# EAGLE schematic Mini Power Supply (EAGLE 6.4)
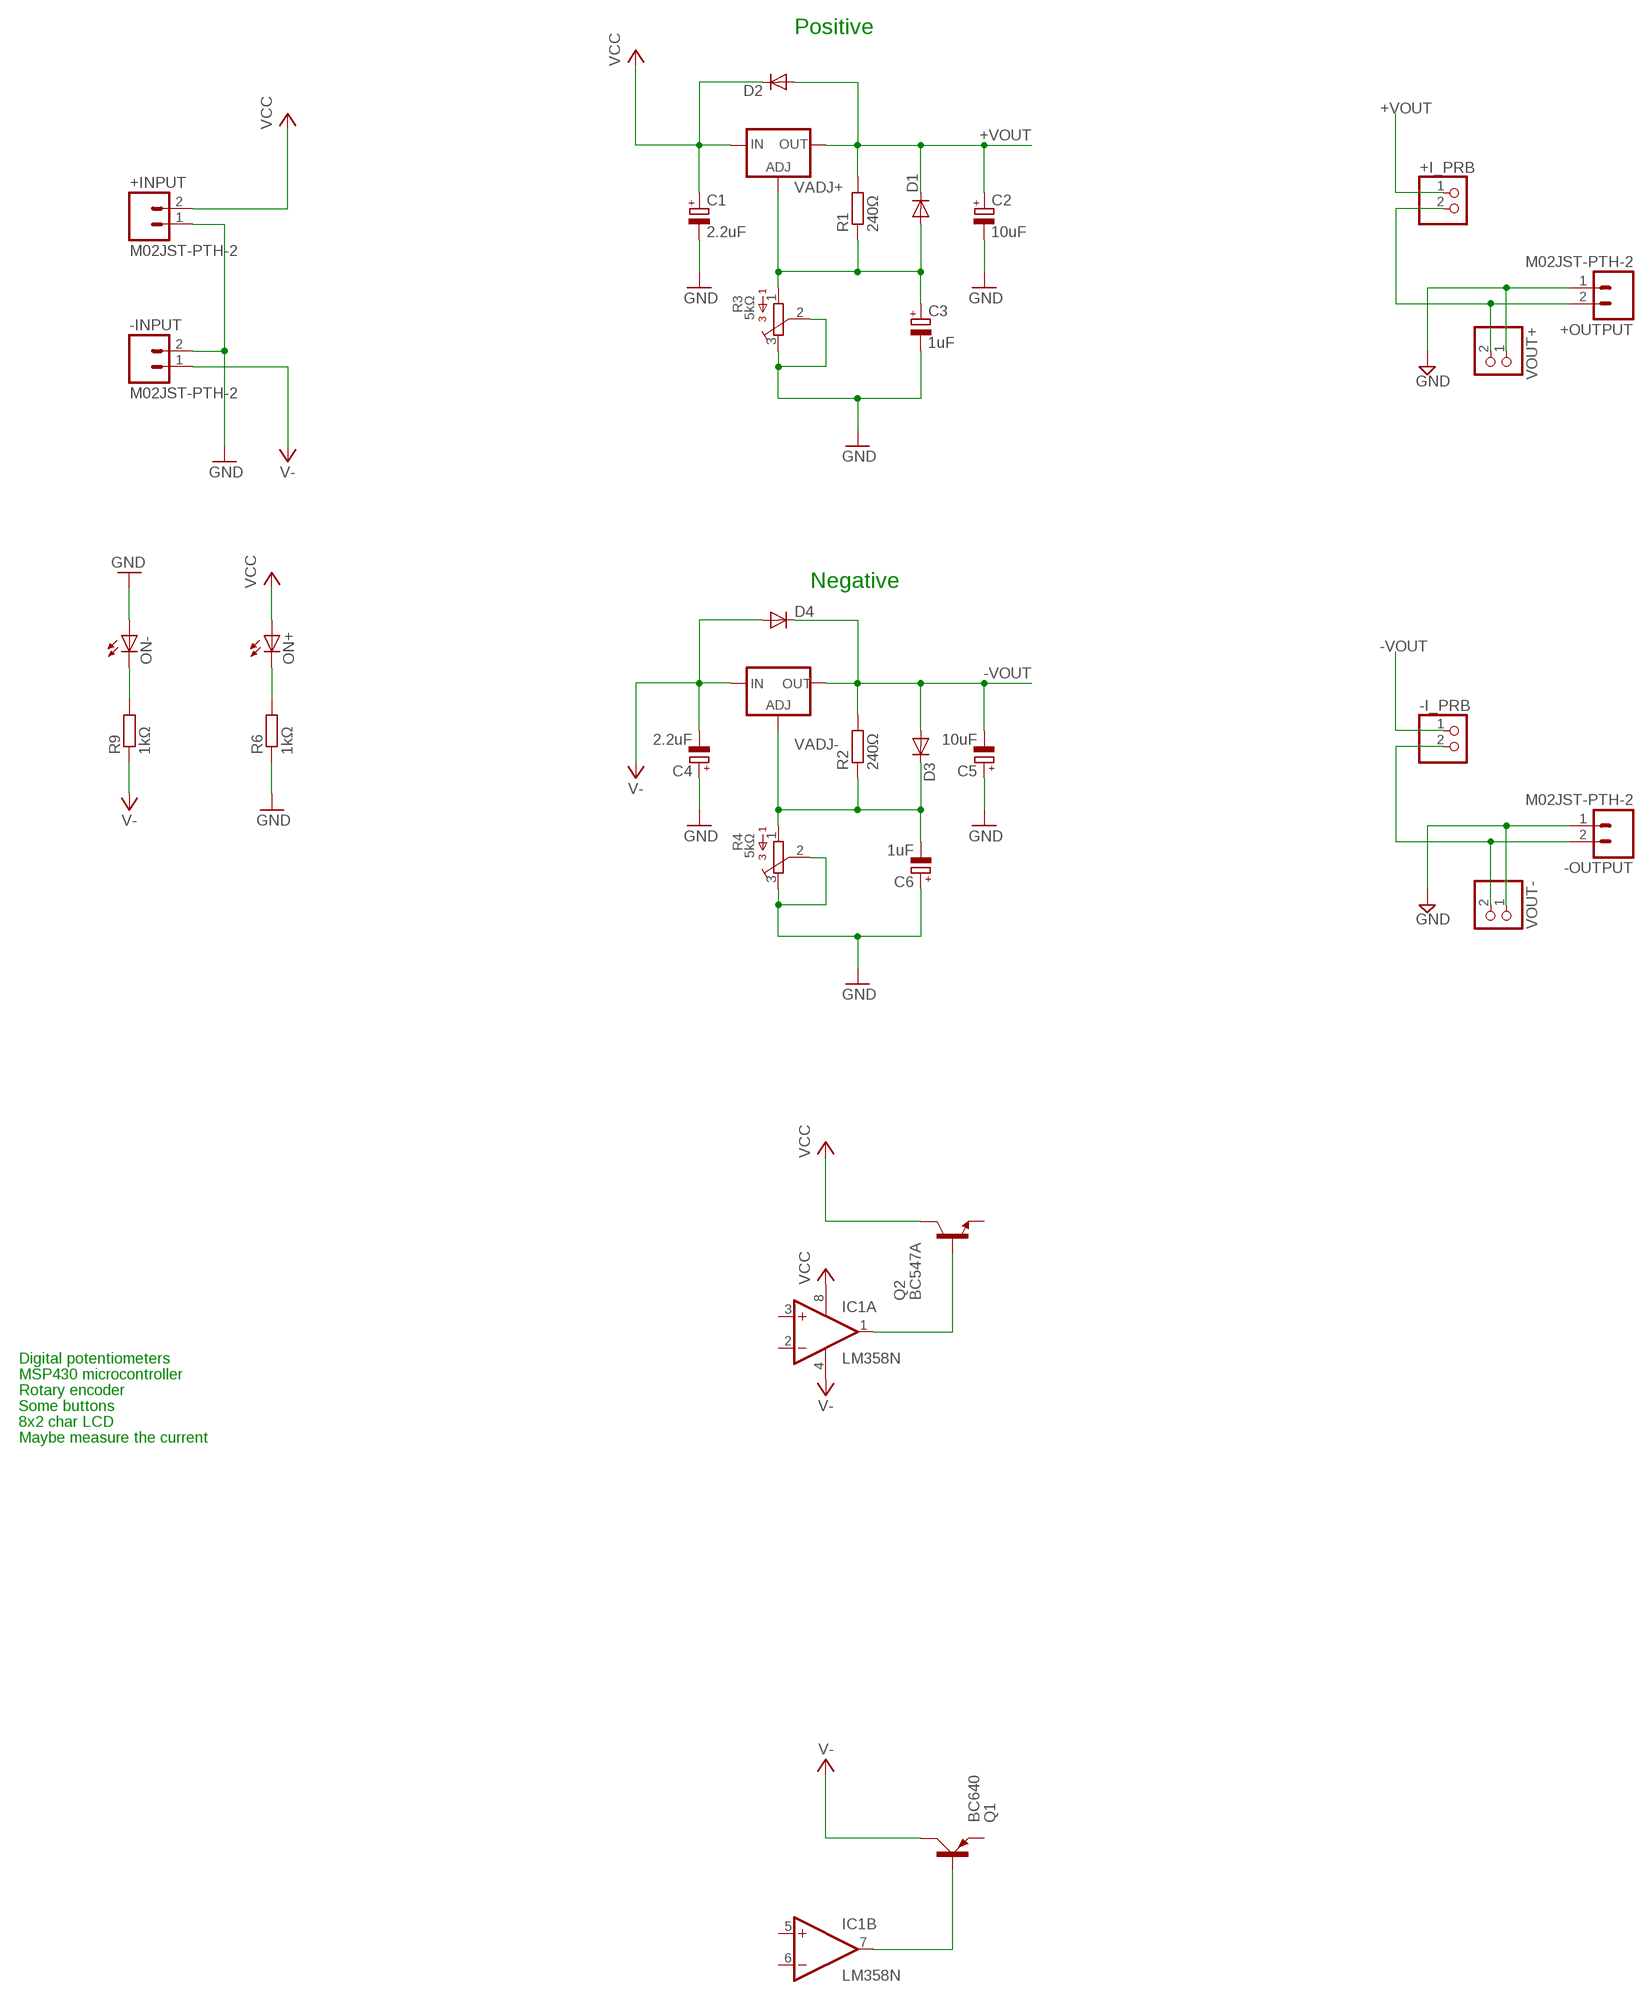
[diagram p0: schematic, sheet 1]

## Parts
+I_PRB  PINHD-1X2  [1X02]
+INPUT  M02JST-PTH-2  [JST-2-PTH]
+OUTPUT  M02JST-PTH-2  [JST-2-PTH]
-I_PRB  PINHD-1X2  [1X02]
-INPUT  M02JST-PTH-2  [JST-2-PTH]
-OUTPUT  M02JST-PTH-2  [JST-2-PTH]
C1  2.2uF  CPOL-EUE2.5-6  [E2,5-6]
C2  10uF  CPOL-EUE2.5-6  [E2,5-6]
C3  1uF  CPOL-EUE2.5-6  [E2,5-6]
C4  2.2uF  CPOL-EUE2.5-6  [E2,5-6]
C5  10uF  CPOL-EUE2.5-6  [E2,5-6]
C6  1uF  CPOL-EUE2.5-6  [E2,5-6]
D1  1N4148DO35-7  [DO35-7]
D2  1N4148DO35-7  [DO35-7]
D3  1N4148DO35-7  [DO35-7]
D4  1N4148DO35-7  [DO35-7]
IC1  LM358N  [DIL08]
ON+  LEDSQR2X5  [LED2X5]
ON-  LEDSQR2X5  [LED2X5]
Q1  BC640  [SOT54D]
Q2  BC547A  [TO92]
R1  240Ω  R-EU_0207/10  [0207/10]
R2  240Ω  R-EU_0207/10  [0207/10]
R3  5kΩ  3386-U  [3386U]
R4  5kΩ  3386-U  [3386U]
R6  1kΩ  R-EU_0207/10  [0207/10]
R9  1kΩ  R-EU_0207/10  [0207/10]
VADJ+  LM317L  [317L]
VADJ-  LM337L  [337L]
VOUT+  PINHD-1X2  [1X02]
VOUT-  PINHD-1X2  [1X02]

## Nets
+VOUT: +I_PRB.1 C2.+ D1.C D2.A R1.2 VADJ+.2(OUT)
-VOUT: -I_PRB.1 C5.- D3.A D4.C R2.2 VADJ-.OUT
GND: +INPUT.1 +OUTPUT.1 -INPUT.2 -OUTPUT.1 C1.- C2.- C3.- C4.+ C5.+ C6.+ ON-.A R3.2 R3.3 R4.2 R4.3 R6.1 VOUT+.1 VOUT-.1
N$1: C6.- D3.C R2.1 R4.1 VADJ-.ADJ
N$2: IC1.1(A:OUT) Q2.2(B)
N$3: C3.+ D1.A R1.1 R3.1 VADJ+.1(ADJ)
N$4: ON-.K(C) R9.2
N$5: IC1.7(B:OUT) Q1.B
N$6: ON+.K(C) R6.2
N$7: +I_PRB.2 +OUTPUT.2 VOUT+.2
N$10: -I_PRB.2 -OUTPUT.2 VOUT-.2
V-: -INPUT.1 C4.- D4.A IC1.4(P:V-) Q1.C R9.1 VADJ-.IN
VCC: +INPUT.2 C1.+ D2.C IC1.8(P:V+) ON+.A Q2.3(C) VADJ+.3(IN)
Unconnected: IC1.2(A:-IN) IC1.3(A:+IN) IC1.5(B:+IN) IC1.6(B:-IN) Q1.E Q2.1(E)

## Notes on the sheet
- Positive
- Negative
- Digital potentiometers
- MSP430 microcontroller
- Rotary encoder
- Some buttons
- 8x2 char LCD
- Maybe measure the current

## Library data of the parts
+I_PRB -I_PRB VOUT+ VOUT- = pinhead:PINHD-1X2: PIN HEADER
+INPUT +OUTPUT -INPUT -OUTPUT = SparkFun-Connectors:M02: Standard 2-pin 0.1" header. Use with - straight break away headers ( PRT-00116) - right angle break away headers (PRT-00553) - swiss pins (PRT-00743) - machine pins (PRT-00117) - female headers (PRT-00115) Molex polarized connector foot print use with: PRT-08233 with associated crimp pins and housings. 2.54_SCREWTERM for use with PRT-10571. 3.5mm Screw Terminal footprints for PRT-08084 5mm Screw Terminal footprints for use with PRT-08433
C1-C6 = rcl:CPOL-EU: POLARIZED CAPACITOR, European symbol
D1-D4 = diode:1N4148: DIODE high speed (Philips)
IC1 = linear:LM358: OP AMP also LM158; LM258; LM2904 Source: http://cache.national.com/ds/LM/LM158.pdf
ON+ ON- = led:LED: LED OSRAM: - CHIPLED LG R971, LG N971, LY N971, LG Q971, LY Q971, LO R971, LY R971 LH N974, LH R974 LS Q976, LO Q976, LY Q976 LO Q996 - Hyper CHIPLED LW Q18S LB Q993, LB Q99A, LB R99A - SideLED LS A670, LO A670, LY A670, LG A670, LP A670 LB A673, LV A673, LT A673, LW A673 LH A674 LY A675 LS A676, LA A676, LO A676, LY A676, LW A676 LS A679, LY A679, LG A679 - Hyper Micro SIDELED® LS Y876, LA Y876, LO Y876, LY Y876 LT Y87S - SmartLED LW L88C, LW L88S LB L89C, LB L89S, LG L890 LS L89K, LO L89K, LY L89K LS L896, LA L896, LO L896, LY L896 - TOPLED LS T670, LO T670, LY T670, LG T670, LP T670 LSG T670, LSP T670, LSY T670, LOP T670, LYG T670 LG T671, LOG T671, LSG T671 LB T673, LV T673, LT T673, LW T673 LH T674 LS T676, LA T676, LO T676, LY T676, LB T676, LH T676, LSB T676, LW T676 LB T67C, LV T67C, LT T67C, LS T67K, LO T67K, LY T67K, LW E67C LS E67B, LA E67B, LO E67B, LY E67B, LB E67C, LV E67C, LT E67C LW T67C LS T679, LY T679, LG T679 LS T770, LO T770, LY T770, LG T770, LP T770 LB T773, LV T773, LT T773, LW T773 LH T774 LS E675, LA E675, LY E675, LS T675 LS T776, LA T776, LO T776, LY T776, LB T776 LHGB T686 LT T68C, LB T68C - Hyper Mini TOPLED® LB M676 - Mini TOPLED Santana® LG M470 LS M47K, LO M47K, LY M47K Source: http://www.osram.convergy.de LUXEON: - LUMILED® LXK2-PW12-R00, LXK2-PW12-S00, LXK2-PW14-U00, LXK2-PW14-V00 LXK2-PM12-R00, LXK2-PM12-S00, LXK2-PM14-U00 LXK2-PE12-Q00, LXK2-PE12-R00, LXK2-PE12-S00, LXK2-PE14-T00, LXK2-PE14-U00 LXK2-PB12-K00, LXK2-PB12-L00, LXK2-PB12-M00, LXK2-PB14-N00, LXK2-PB14-P00, LXK2-PB14-Q00 LXK2-PR12-L00, LXK2-PR12-M00, LXK2-PR14-Q00, LXK2-PR14-R00 LXK2-PD12-Q00, LXK2-PD12-R00, LXK2-PD12-S00 LXK2-PH12-R00, LXK2-PH12-S00 LXK2-PL12-P00, LXK2-PL12-Q00, LXK2-PL12-R00 Source: www.luxeon.com KINGBRIGHT: KA-3528ASYC Source: www.kingbright.com
Q1 = transistor-small-signal:BC640: PNP TRANSISTOR
Q2 = transistor-npn:BC547*: NPN Transistor
R1 R2 R6 R9 = resistor:R-EU_: RESISTOR, European symbol
R3 R4 = bourns:3386-: 3386 Series 3/8" Square Trimmer
VADJ+ = v-reg:LM317L: VOLTAGE REGULATOR
VADJ- = v-reg:LM337L: VOLTAGE REGULATOR